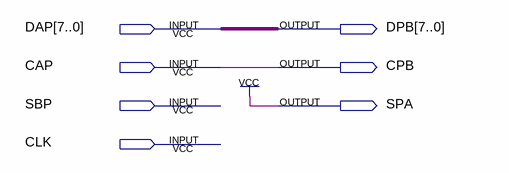
[diagram p0: schematic sheet]
// Quartus schematic P.bdf as structural Verilog: 0 symbols, 7 pins
module P (
  input  [7:0] DAP,
  input  CAP,
  input  SBP,
  input  CLK,
  output [7:0] DPB,
  output CPB,
  output SPA
);


  assign CPB = CAP;
  assign DPB = DAP;
  assign SPA = 1'b1;
endmodule
